# Altium schematic sheet 26_RS485.SchDoc
size A4
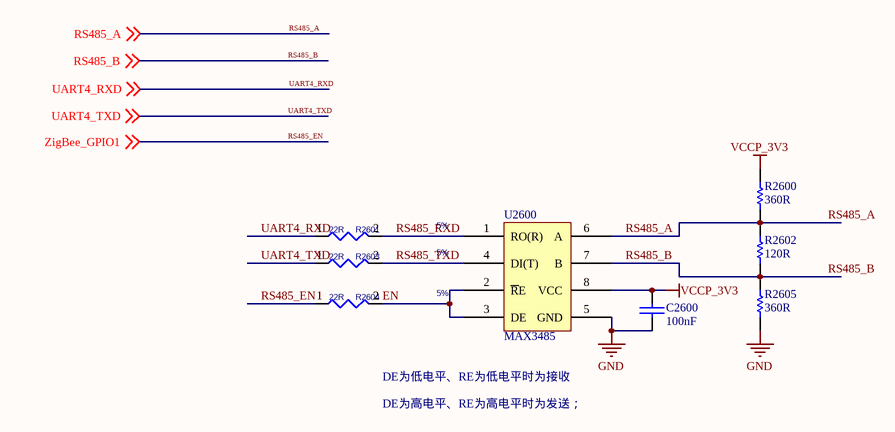
[diagram p0: 26_RS485.SchDoc]

## Parts
C2600  100nF  [C0402]
R2600  360R  [R0402]
R2601  22R  Tolerance: 5%  [R0402]
R2602  120R  [R0402]
R2603  22R  Tolerance: 5%  [R0402]
R2604  22R  Tolerance: 5%  [R0402]
R2605  360R  [R0402]
U2600  MAX3485  [MSOP-8]

## Nets
GND: C2600.1 R2605.1 U2600.5(GND)
VCCP_3V3: C2600.2 R2600.2 U2600.8(VCC)
EN: R2604.2 U2600.2(~{R}E) U2600.3(DE)
RS485_A: R2600.1 R2602.2 U2600.6(A) ; off-sheet RS485_A
RS485_B: R2602.1 R2605.2 U2600.7(B) ; off-sheet RS485_B
RS485_EN: R2604.1 ; off-sheet ZigBee_GPIO1  [also labelled ZigBee_GPIO1]
RS485_RXD: R2601.2 U2600.1(RO(R))
RS485_TXD: R2603.2 U2600.4(DI(T))
UART4_RXD: R2601.1 ; off-sheet UART4_RXD
UART4_TXD: R2603.1 ; off-sheet UART4_TXD

## Notes on the sheet
- DE为低电平、RE为低电平时为接收
- DE为高电平、RE为高电平时为发送；

## Library data of the parts
C2600 = CAP: 无极性电容
R2600 R2602 R2605 = RES
R2601 R2603 R2604 = RESISTOR_Dup1: 通用厚膜电阻,22R,+/-5%,R0402,1/16W.; Manufacturer: YAGEO; RK PN: RC0402JR-0722RL; Priority: A; Wattage: 1/16W; Part Type: 通用厚膜电阻; Manufacturer PN: RC0402JR-0722RL; Created by: YTL
U2600 = MAX485